# Altium project golgi_bot.PrjPcb
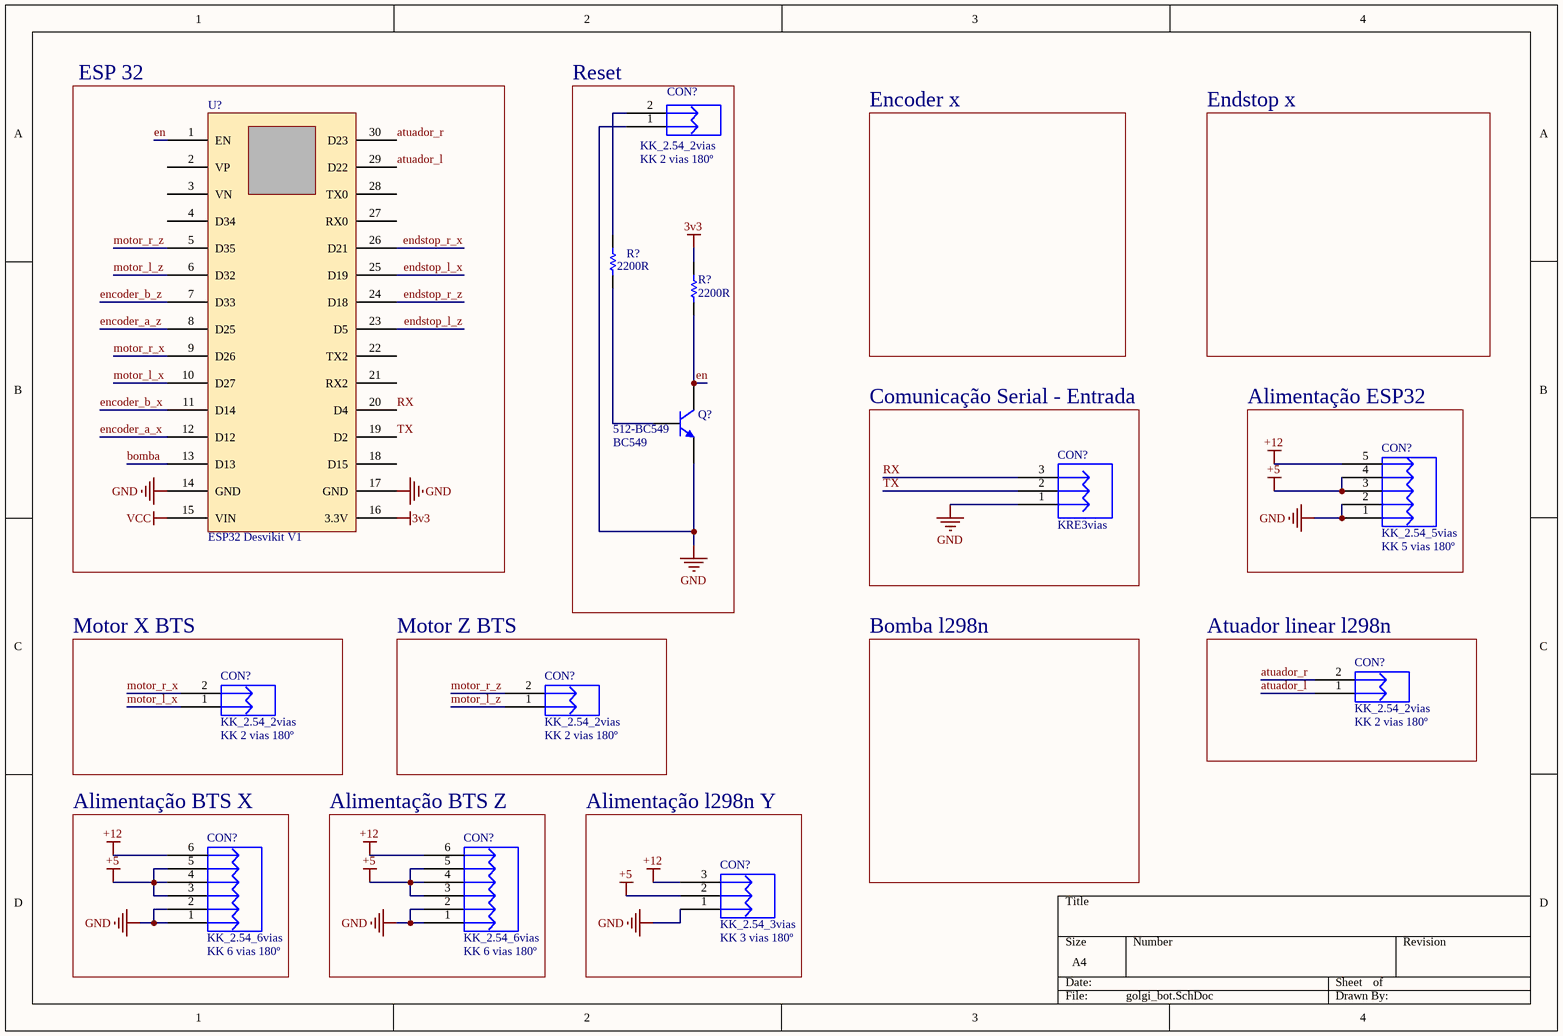
[diagram p0: golgi_bot.SchDoc]
1 sheet, 13 parts. Net scope: global (net labels, ports and power ports of the same name join across sheets).
Board file: golgi_bot.PcbDoc

## Sheet golgi_bot.SchDoc
size A4; SheetNumber: 1; SheetTotal: 2

### Parts
(Parts that share a designator on the sheet are numbered #1, #2 ... from top to bottom, then left to right.)
CON?#1  KK_2.54_2vias  Valor: KK 2 vias 180º  [KK_2VIAS_180º]
CON?#2  KRE3vias  [KRE3-3vias]
CON?#3  KK_2.54_5vias  Valor: KK 5 vias 180º  [KK_5vias_180°]
CON?#4  KK_2.54_2vias  Valor: KK 2 vias 180º  [KK_2VIAS_180º]
CON?#5  KK_2.54_2vias  Valor: KK 2 vias 180º  [KK_2VIAS_180º]
CON?#6  KK_2.54_2vias  Valor: KK 2 vias 180º  [KK_2VIAS_180º]
CON?#7  KK_2.54_3vias  Valor: KK 3 vias 180º  [KK_3vias_180º]
CON?#8  KK_2.54_6vias  Valor: KK 6 vias 180º  [KK_6vias_180°]
CON?#9  KK_2.54_6vias  Valor: KK 6 vias 180º  [KK_6vias_180°]
Q?  BC549  Supplier Part Number 1: 512-BC549  [TO92]
R?#1  Resistance (Ohms): 2200R  [RES 470R 1/4W CARBON FILM]  (hidden comment: RES 470R 1/4W CARBON FILM)
R?#2  Resistance (Ohms): 2200R  [RES 470R 1/4W CARBON FILM]  (hidden comment: RES 470R 1/4W CARBON FILM)
U?  value ESP32 Desvikit V1  [ESP32_Desvikit_v1]  (hidden comment: microcontrolador)

### Blocks framed on the sheet
ESP 32: U?
Reset: CON?#1 Q? R?#1 R?#2
Comunicação Serial - Entrada: CON?#2
Alimentação ESP32: CON?#3
Motor X BTS: CON?#5
Motor Z BTS: CON?#6
Atuador linear l298n: CON?#4
Alimentação BTS X: CON?#8
Alimentação BTS Z: CON?#9
Alimentação l298n Y: CON?#7

### Nets
3v3: R?#2.2 U?.16(3.3V)
+5: CON?#3.3 CON?#3.4 CON?#7.2 CON?#8.3 CON?#8.4 CON?#8.5 CON?#9.3 CON?#9.4 CON?#9.5
+12: CON?#3.5 CON?#7.3 CON?#8.6 CON?#9.6
GND: CON?#1.1 CON?#2.1 CON?#3.1 CON?#3.2 CON?#7.1 CON?#8.1 CON?#8.2 CON?#9.1 CON?#9.2 Q?.3(E) U?.14(GND) U?.17(GND)
VCC: U?.15(VIN)
atuador_l: CON?#4.1 U?.29(D22)
atuador_r: CON?#4.2 U?.30(D23)
bomba: U?.13(D13)
en: Q?.1(C) R?#2.1 U?.1(EN)
encoder_a_x: U?.12(D12)
encoder_a_z: U?.8(D25)
encoder_b_x: U?.11(D14)
encoder_b_z: U?.7(D33)
endstop_l_x: U?.25(D19)
endstop_l_z: U?.23(D5)
endstop_r_x: U?.26(D21)
endstop_r_z: U?.24(D18)
motor_l_x: CON?#5.1 U?.10(D27)
motor_l_z: CON?#6.1 U?.6(D32)
motor_r_x: CON?#5.2 U?.9(D26)
motor_r_z: CON?#6.2 U?.5(D35)
RX: CON?#2.3 U?.20(D4)
TX: CON?#2.2 U?.19(D2)
NetCON?#1_2: CON?#1.2 R?#1.2
NetQ?_2: Q?.2(B) R?#1.1

Not connected (* = marked no-connect by the designer): U? 2(VP) 3(VN) 4(D34) 18(D15) 21(RX2) 22(TX2) 27(RX0) 28(TX0)

### Notes on the sheet
- Encoder x
- Endstop x
- Bomba l298n

### Library data of the parts
CON?#1 CON?#4-CON?#6 = KK_2.54_2vias: Conector KK 2.54mm 2 vias; Descrição: Conector KK 3 vias com passo 2.54mm; Encapsulamento: PTH - 180º; Modelo: 2 vias - 180º; Marca: *; Observação: *
CON?#2 = KRE3vias: Conector 3 vias; Descrição: Conector KRE 3 vias 180º; Encapsulamento: PTH - 180º; Modelo: 3 vias - 180º; Marca: *; Observação: *
CON?#3 = KK_2.54_5vias: Conector KK 2.54mm 5 vias; Descrição: Conector KK 3 vias com passo 2.54mm; Encapsulamento: PTH - 180º; Modelo: 3 vias - 180º; Marca: *; Observação: *
CON?#7 = KK_2.54_3vias: Conector KK 2.54mm 3 vias; Descrição: Conector KK 3 vias com passo 2.54mm; Encapsulamento: PTH - 180º; Modelo: 3 vias - 180º; Marca: *; Observação: *
CON?#8 CON?#9 = KK_2.54_6vias: Conector KK 2.54mm 6 vias; Descrição: Conector KK 3 vias com passo 2.54mm; Encapsulamento: PTH - 180º; Modelo: 3 vias - 180º; Marca: *; Observação: *
Q? = BC549: TRANS NPN 30V 0.1A TO-92; Manufacturer: Fairchild Semiconductor; Configuration: Single; Emitter- Base Voltage VEBO: 5 V; Collector-Emitter Saturation Voltage: 200 mV; Gain Bandwidth Product fT: 300 MHz; DC Collector/Base Gain hfe Min: 110; DC Current Gain hFE Max: 800; Maximum Power Dissipation: 0.5 W; Supplier 1: Mouser; Manufacturer Part Number: BC549; Product Category: Bipolar Transistors - BJT; RoHS: Details; Transistor Polarity: NPN; Collector- Base Voltage VCBO: 30 V; Collector- Emitter Voltage VCEO Max: 30 V; Maximum DC Collector Current: 0.1 A; Maximum Operating Temperature: + 150 C; Mounting Style: Through Hole; Package / Case: TO-92-3; Brand: Fairchild Semiconductor; Minimum Operating Temperature: - 65 C; Packaging: Bulk; Series: BC549; Factory Pack Quantity: 2000; ComponentLink1URL: https://datasheet.ciiva.com/982/bc546-982130.pdf; ComponentLink1Description: https://datasheet.ciiva.com/982/bc546-982130.pdf; ComponentLink2URL: https://datasheet.ciiva.com/17179/bc549-17179663.pdf; ComponentLink2Description: https://datasheet.ciiva.com/17179/bc549-17179663.pdf
R?#1 R?#2 = RES 470R 1/4W CARBON FILM: RES 470R OHM 1/4W 5% CARBON FILM; Manufacturer: Ty-Ohm; Manufacturer Part Number: CR25; Power (Watts): 0.25W, 1/4W; Temperature Coefficient: 0/ -500ppm/°C; Supplier 1: Mult Comercial; RoHS: RoHS Compliant; Category: Resistors; Stock 1: 617543; Pricing 1: 1=0.20 (BRL); Packaging: Cut Tape (CT); Tolerance: ±5%; Composition: Carbon Film; Features: Flame Retardant Coating, Safety; Operating Temperature: -55°C ~ 155°C; Package / Case: Axial; Supplier Device Package: Axial; Size / Dimension: 0.091" Dia x 0.256" L (2.30mm x 6.50mm); Height: -; Number of Terminations: 2; ComponentLink1URL: http://loja.multcomercial.com.br/resistor-de-1-4-de-watt-cr25-5-de-tolerancia.html; ComponentLink1Description: http://loja.multcomercial.com.br/resistor-de-1-4-de-watt-cr25-5-de-tolerancia.html; Supplier Part Number 1: Resistor de Filme de Carbono 1/4 de Watt CR25 5% de tolerância - 0.22R Ω à 10M Ω
U? = ESP32 Desvikit v1: microcontrolador com moculo bluethoth e wifi